# Altium schematic sheet JBC_PD_MCU.SchDoc
size A4
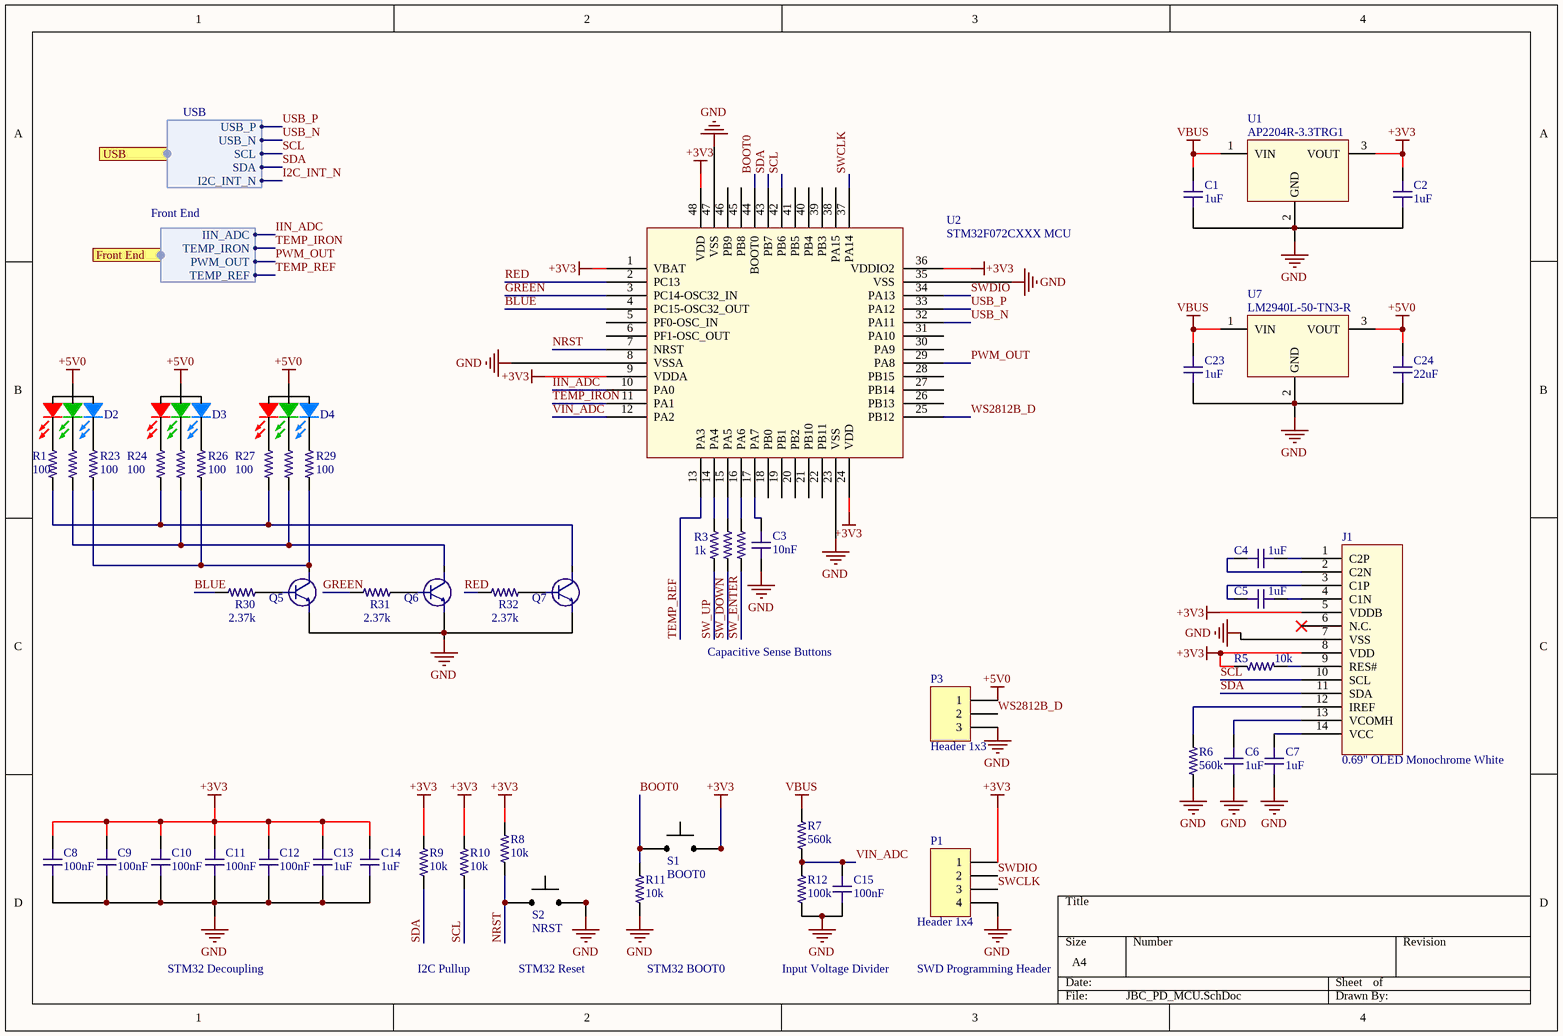
[diagram p0: JBC_PD_MCU.SchDoc]

## Parts
C1  value 1uF  [C0603-IPC]  (hidden comment: C0603 1uF 25V X7R)
C2  value 1uF  [C0603-IPC]  (hidden comment: C0603 1uF 25V X7R)
C3  value 10nF  [C0603-IPC]  (hidden comment: Cs 10nF 50V X7R)
C4  value 1uF  [C0603-IPC]  (hidden comment: C0603 1uF 25V X7R)
C5  value 1uF  [C0603-IPC]  (hidden comment: C0603 1uF 25V X7R)
C6  value 1uF  [C0603-IPC]  (hidden comment: C0603 1uF 25V X7R)
C7  value 1uF  [C0603-IPC]  (hidden comment: C0603 1uF 25V X7R)
C8  value 100nF  [C0603-IPC]  (hidden comment: C0603 100nF 25V X7R)
C9  value 100nF  [C0603-IPC]  (hidden comment: C0603 100nF 25V X7R)
C10  value 100nF  [C0603-IPC]  (hidden comment: C0603 100nF 25V X7R)
C11  value 100nF  [C0603-IPC]  (hidden comment: C0603 100nF 25V X7R)
C12  value 100nF  [C0603-IPC]  (hidden comment: C0603 100nF 25V X7R)
C13  value 1uF  [C0603-IPC]  (hidden comment: C0603 1uF 25V X7R)
C14  value 1uF  [C0603-IPC]  (hidden comment: C0603 1uF 25V X7R)
C15  value 100nF  [C0603-IPC]  (hidden comment: C0603 100nF 25V X7R)
C23  value 1uF  [C0603-IPC]  (hidden comment: C0603 1uF 25V X7R)
C24  value 22uF  [C0603-IPC]  (hidden comment: C0603 22uF 10V X5R)
D2  RGB  [LED_0606_RGB_WURTH - Reverse Mount]  (value not drawn)
D3  RGB  [LED_0606_RGB_WURTH - Reverse Mount]  (value not drawn)
D4  RGB  [LED_0606_RGB_WURTH - Reverse Mount]  (value not drawn)
J1  0.69" OLED Monochrome White  [OLED_64x32 Bent]
P1  Header 1x4  [HEADER 1X4 SMD 2.54mm]
P3  Header 1x3  [HEADER 1X3 SMD 2.54mm]
Q5  MMBT3904LT1G  [SOT23-MMBT3904]  (value not drawn)
Q6  MMBT3904LT1G  [SOT23-MMBT3904]  (value not drawn)
Q7  MMBT3904LT1G  [SOT23-MMBT3904]  (value not drawn)
R1  value 100  [R0603-IPC]  (hidden comment: R0603 100 1%)
R2  R0603 1K 1%  [R0603-IPC]  (value not drawn)
R3  value 1k  [R0603-IPC]  (hidden comment: R0603 1K 1%)
R4  R0603 1K 1%  [R0603-IPC]  (value not drawn)
R5  value 10k  [R0603-IPC]  (hidden comment: R0603 10K 1%)
R6  value 560k  [R0603-IPC]  (hidden comment: R0603 560K 1%)
R7  value 560k  [R0603-IPC]  (hidden comment: R0603 560K 1%)
R8  value 10k  [R0603-IPC]  (hidden comment: R0603 10K 1%)
R9  value 10k  [R0603-IPC]  (hidden comment: R0603 10K 1%)
R10  value 10k  [R0603-IPC]  (hidden comment: R0603 10K 1%)
R11  value 10k  [R0603-IPC]  (hidden comment: R0603 10K 1%)
R12  value 100k  [R0603-IPC]  (hidden comment: R0603 100K 1%)
R22  R0603 100 1%  [R0603-IPC]  (value not drawn)
R23  value 100  [R0603-IPC]  (hidden comment: R0603 100 1%)
R24  value 100  [R0603-IPC]  (hidden comment: R0603 100 1%)
R25  R0603 100 1%  [R0603-IPC]  (value not drawn)
R26  value 100  [R0603-IPC]  (hidden comment: R0603 100 1%)
R27  value 100  [R0603-IPC]  (hidden comment: R0603 100 1%)
R28  R0603 100 1%  [R0603-IPC]  (value not drawn)
R29  value 100  [R0603-IPC]  (hidden comment: R0603 100 1%)
R30  value 2.37k  [R0603-IPC]  (hidden comment: R0603 2.37K 1%)
R31  value 2.37k  [R0603-IPC]  (hidden comment: R0603 2.37K 1%)
R32  value 2.37k  [R0603-IPC]  (hidden comment: R0603 2.37K 1%)
S1  BOOT0  [TL3342F260QG]
S2  NRST  [TL3342F260QG]
U1  AP2204R-3.3TRG1  [SOT-89]
U2  STM32F072CXXX MCU  [LQFP48]
U7  LM2940L-50-TN3-R  [DPAK2]

## Ports
Front End (harness Front End), USB (harness USB)

## Harnesses
USB: USB_P, USB_N, SCL, SDA, I2C_INT_N
Front End: IIN_ADC, TEMP_IRON, PWM_OUT, TEMP_REF

## Nets
+3V3: C2.1 C8.2 C9.2 C10.2 C11.2 C12.2 C13.1 C14.1 J1.5(VDDB) J1.8(VDD) P1.1 R5.1 R8.2 R9.2 R10.2 S1.1 S1.2 U1.3(VOUT) U2.1(VBAT) U2.9(VDDA) U2.24(VDD) U2.36(VDDIO2) U2.48(VDD)
+5V0: C24.2 D2.A D3.A D4.A P3.1 U7.3(VOUT)
GND: C1.2 C2.2 C3.1 C6.2 C7.2 C8.1 C9.1 C10.1 C11.1 C12.1 C13.2 C14.2 C15.1 C23.2 C24.1 J1.7(VSS) P1.4 P3.3 Q5.2(E) Q6.2(E) Q7.2(E) R6.1 R11.1 R12.1 S2.1 S2.2 U1.2(GND) U2.8(VSSA) U2.23(VSS) U2.35(VSS) U2.47(VSS) U7.2(GND)
VBUS: C1.1 C23.1 R7.2 U1.1(VIN) U7.1(VIN)
BLUE: R30.1 U2.4(PC15-OSC32_OUT)
BOOT0: R11.2 S1.3 S1.4 U2.44(BOOT0)
GREEN: R31.1 U2.3(PC14-OSC32_IN)
I2C_INT_N: port USB.I2C_INT_N
IIN_ADC: U2.10(PA0) ; port Front End.IIN_ADC
NRST: R8.1 S2.3 S2.4 U2.7(NRST)
PWM_OUT: U2.29(PA8) ; port Front End.PWM_OUT
RED: R32.1 U2.2(PC13)
SCL: J1.10(SCL) R10.1 U2.42(PB6) ; port USB.SCL
SDA: J1.11(SDA) R9.1 U2.43(PB7) ; port USB.SDA
SW_DOWN: R2.1
SW_ENTER: R4.1
SW_UP: R3.1
SWCLK: P1.3 U2.37(PA14)
SWDIO: P1.2 U2.34(PA13)
TEMP_IRON: U2.11(PA1) ; port Front End.TEMP_IRON
TEMP_REF: U2.13(PA3) ; port Front End.TEMP_REF
USB_N: U2.32(PA11) ; port USB.USB_N
USB_P: U2.33(PA12) ; port USB.USB_P
VIN_ADC: C15.2 R7.1 R12.2 U2.12(PA2)
WS2812B_D: P3.2 U2.25(PB12)
NetC3_2: C3.2 U2.17(PA7)
NetC4_1: C4.1 J1.2(C2N)
NetC4_2: C4.2 J1.1(C2P)
NetC5_1: C5.1 J1.3(C1P)
NetC5_2: C5.2 J1.4(C1N)
NetC6_1: C6.1 J1.13(VCOMH)
NetC7_1: C7.1 J1.14(VCC)
NetD2_BK: D2.BK R23.2
NetD2_GK: D2.GK R22.2
NetD2_RK: D2.RK R1.2
NetD3_BK: D3.BK R26.2
NetD3_GK: D3.GK R25.2
NetD3_RK: D3.RK R24.2
NetD4_BK: D4.BK R29.2
NetD4_GK: D4.GK R28.2
NetD4_RK: D4.RK R27.2
NetJ1_9: J1.9(RES#) R5.2
NetJ1_12: J1.12(IREF) R6.2
NetQ5_1: Q5.1(B) R30.2
NetQ5_3: Q5.3(C) R23.1 R26.1 R29.1
NetQ6_1: Q6.1(B) R31.2
NetQ6_3: Q6.3(C) R22.1 R25.1 R28.1
NetQ7_1: Q7.1(B) R32.2
NetQ7_3: Q7.3(C) R1.1 R24.1 R27.1
NetR2_2: R2.2 U2.15(PA5)
NetR3_2: R3.2 U2.14(PA4)
NetR4_2: R4.2 U2.16(PA6)

Not connected (* = marked no-connect by the designer): J1 6(N.C.)*; U2 5(PF0-OSC_IN) 6(PF1-OSC_OUT) 18(PB0) 19(PB1) 20(PB2) 21(PB10) 22(PB11) 26(PB13) 27(PB14) 28(PB15) 30(PA9) 31(PA10) 38(PA15) 39(PB3) 40(PB4) 41(PB5) 45(PB8) 46(PB9)

## Notes on the sheet
- Capacitive Sense Buttons
- STM32 Decoupling
- I2C Pullup
- STM32 Reset
- STM32 BOOT0
- Input Voltage Divider
- SWD Programming Header

## Library data of the parts
C1 C2 C4-C7 C13 C14 C23 = C0603 1uF 25V X7R: CAP CER 1UF 25V X7R 0603; EIA Code: X7R; Max. Voltage: 25V; Features: Soft Termination; Supplier 1: Digi-Key; Supplier Part Number 1: 445-173615-1-ND
C3 = C0603 10nF 50V X7R: CAP CER 10000PF 50V X7R 0603; EIA Code: X7R; Max. Voltage: 50V; Features: Soft Termination; Supplier 1: Digi-Key; Supplier Part Number 1: 490-10892-1-ND
C8-C12 C15 = C0603 100nF 25V X7R: Chip Capacitor, 0603, 100nF, 25V, X7R; EIA Code: X7R; Max. Voltage: 25V; Supplier 1: Digi-Key; Supplier Part Number 1: 490-1524-1-ND
C24 = C0603 22uF 10V X5R: Chip Capacitor, 0603, 22uF, 10V, X5R; EIA Code: X5R; Max. Voltage: 10V; Supplier 1: Digi-Key; Supplier Part Number 1: 490-10476-1-ND
D2-D4 = Led_RGB_0606: RGB Led 1.6 x 1.6 mm Diffused; Manufacturer: Everlight; Manufacturer Part Number: 19-237/R6GHBHW-C01/2T; Supplier 1: Digi-Key; Supplier Part Number 1: 1080-1590-1-ND
J1 = OLED_64x32: 0.69" OLED Direct Solder Monochrome White; Manufacturer Part Number: UG-9616TSWCG02; Supplier 1: LCSC; Supplier Part Number 1: C88335
P1 = Header 1x4: Header, 4-Pin; LatestRevisionDate: 17-Jul-2002; LatestRevisionNote: Re-released for DXP Platform.; Publisher: Altium Limited
P3 = Header 1x3: Header, 3-Pin; LatestRevisionDate: 17-Jul-2002; LatestRevisionNote: Re-released for DXP Platform.; Publisher: Altium Limited
Q5-Q7 = MMBT3904LT1G: Bipolar (BJT) Transistor NPN 40V 200mA 300MHz 300mW Surface Mount SOT-23-3 (TO-236); I_max: 200mA; V_brkdown: 40V; Supplier 1: Digi-Key; Supplier 2: Mouser; Supplier 3: LCSC; Supplier Part Number 1: MMBT3904LT1GOSDKR-ND; Supplier Part Number 2: 863-MMBT3904LT1G; Supplier Part Number 3: C81464
R1 R23 R24 R26 R27 R29 = R0603 100 1%: RES SMD 100 OHM 1% 1/4W 0603; Power (Watts): 0.25W, 1/4W; Supplier 1: Digi-Key; Supplier Part Number 1: 541-3244-1-ND
R2-R4 = R0603 1K 1%: RES SMD 1K OHM 1% 1/10W 0603; Temperature Coefficient: ±100ppm/°C; Operating Temperature: -55°C ~ 155°C; Features: Automotive AEC-Q200; Tolerance: ±1%; Supplier 1: Digi-Key; Supplier Part Number 1: RMCF0603FG1K00CT-ND
  R2 R4: Value: 1k
R5 R8-R11 = R0603 10K 1%: RES SMD 10K OHM 1% 1/10W 0603; Supplier 1: Digi-Key; Supplier Part Number 1: RMCF0603FT10K0CT-ND
R6 R7 = R0603 560K 1%: RES 560K OHM 1% 1/10W 0603; Supplier 1: Digi-Key; Supplier Part Number 1: RMCF0603FT560KCT-ND
R12 = R0603 100K 1%: RES SMD 100K OHM 1% 1/10W 0603; Supplier 1: Digi-Key; Supplier Part Number 1: RMCF0603FT100KCT-ND
R22 R25 R28 = R0603 100 1%: RES SMD 100 OHM 1% 1/4W 0603; Power (Watts): 0.25W, 1/4W; Value: 100; Supplier 1: Digi-Key; Supplier Part Number 1: 541-3244-1-ND
R30-R32 = R0603 2.37K 1%: RES SMD 2.37K OHM 1% 1/10W 0603; Supplier 1: Digi-Key; Supplier 2: Mouser; Supplier 3: LCSC; Supplier Part Number 3: C403087; Supplier Part Number 2: 667-ERJ-3EKF2371V; Supplier Part Number 1: P2.37KHCT-ND
S1 S2 = SWITCH TACTILE SPST: SWITCH TACTILE SPST-NO 0.05A 12V; Manufacturer Part Number: TL3342F260QG; Supplier 1: Digi-Key; Supplier Part Number 1: EG5470CT-ND
U1 = AP2204R: Fixed 24V 3.3V 150mA SOT-89(SOT-89-3) Low Dropout Regulators(LDO); Supplier 1: Digi-Key; Supplier 2: Mouser; Supplier 3: LCSC; Supplier Part Number 1: AP2204R-3.3TRG1DICT-ND; Supplier Part Number 2: 621-AP2204R-3.3TRG1; Supplier Part Number 3: C156303
U2 = STM32F072CXXX: 32-Bit FLASH ARM® Cortex®-M0 48MHz 1.65V ~ 3.6V LQFP-48_7x7x05P ST Microelectronics RoHS; Supplier 1: Digi-Key; Supplier 2: Mouser; Supplier 3: LCSC; Supplier Part Number 1: 497-18747-1-ND; Supplier Part Number 2: 511-STM32F072CBT6TR; Supplier Part Number 3: C81720
U7 = LM2940L-50-TN3-R: Fixed 26V 5V 1A TO-252-2(DPAK) Low Dropout Regulators(LDO); Supplier 3: LCSC; Supplier Part Number 3: C85225